# EAGLE design stepper-motor-driver (EAGLE 9.6.2)
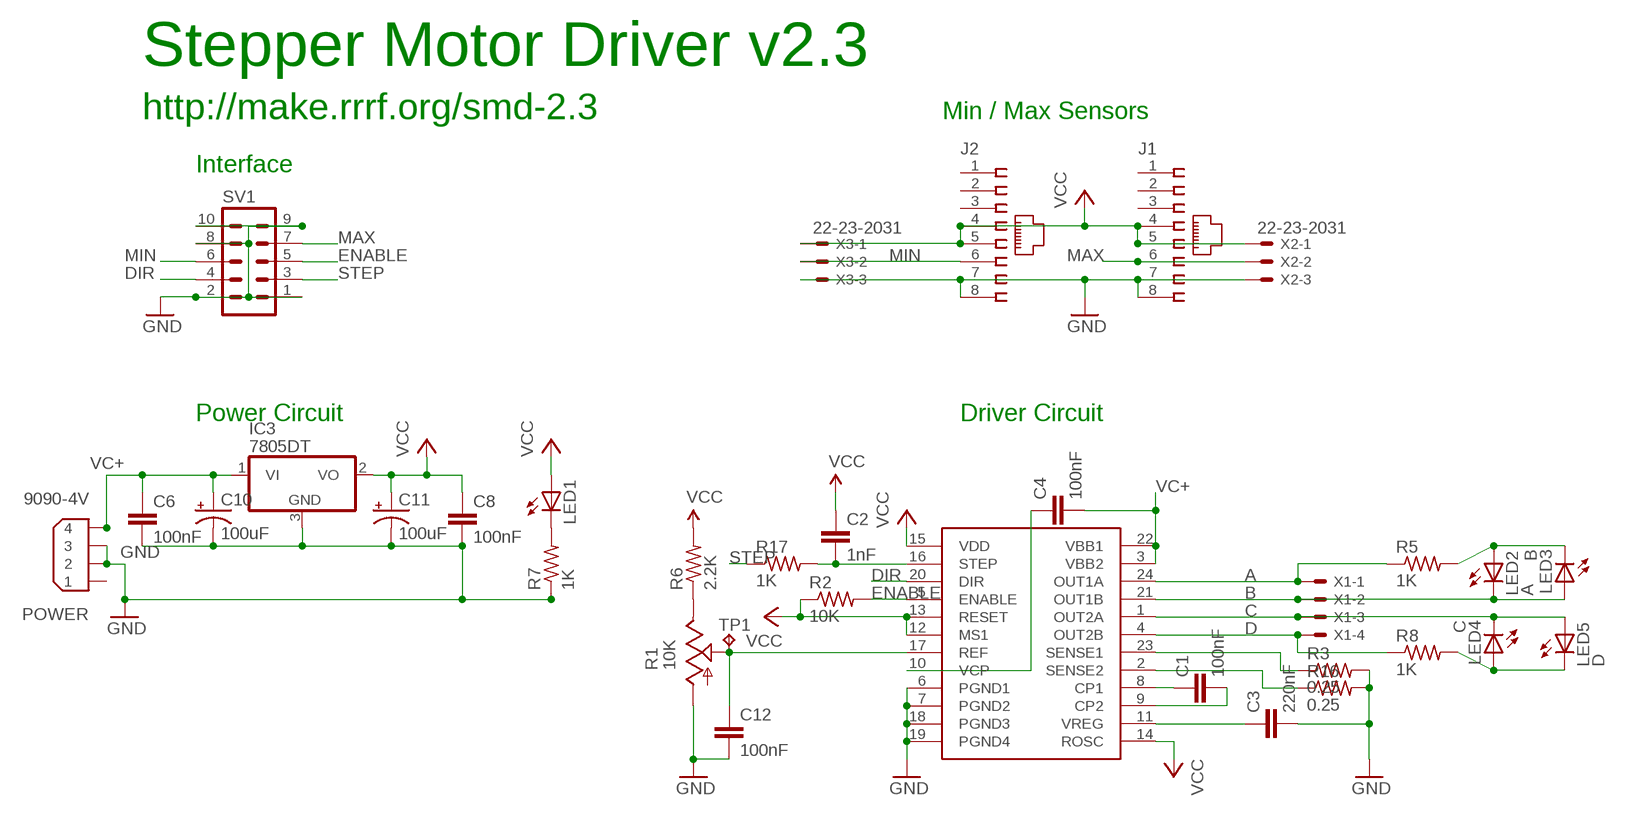
[diagram p0: schematic, sheet 1]

## Parts
C1  100nF  C-EUC1206  [C1206]
C2  1nF  C-EUC1206K  [C1206K]
C3  220nF  C-EUC1206  [C1206]
C4  100nF  C-EUC1206  [C1206]
C6  100nF  C-EUC1206K  [C1206K]
C8  100nF  C-EUC1206K  [C1206K]
C10  100uF  CPOL-USUD-10X10  [UD-10X10_NICHICON]
C11  100uF  CPOL-USUD-10X10  [UD-10X10_NICHICON]
C12  100nF  C-EUC1206  [C1206]
DRIVER  A3982  A3982SOIC24  [SO24W]
IC3  7805DT  [TO252]
J1  520426-4  [520426-4]
J2  520426-4  [520426-4]
LED1  LEDCHIPLED_1206  [CHIPLED_1206]
LED2  A  LEDCHIPLED_1206  [CHIPLED_1206]
LED3  B  LEDCHIPLED_1206  [CHIPLED_1206]
LED4  C  LEDCHIPLED_1206  [CHIPLED_1206]
LED5  D  LEDCHIPLED_1206  [CHIPLED_1206]
POWER  9090-4V  [9090-4V]
R1  10K  TRIM_US-B25P  [B25P]
R2  10K  R-US_R1206  [R1206]
R3  0.25  R-US_R2512  [R2512]
R5  1K  R-US_R1206  [R1206]
R6  2.2K  R-US_R1206  [R1206]
R7  1K  R-US_R1206  [R1206]
R8  1K  R-US_R1206  [R1206]
R16  0.25  R-US_R2512  [R2512]
R17  1K  R-US_R1206  [R1206]
SV1  ML10  [ML10]
TP1  TPPAD1-13  [P1-13]
X1  KK-156-4  [KK-156-4]
X2  22-23-2031  [22-23-2031]
X3  22-23-2031  [22-23-2031]

## Nets
A [Power]: DRIVER.24(OUT1A) R5.1 X1.1
B [Power]: DRIVER.21(OUT1B) LED2.C LED3.A X1.2
C [Power]: DRIVER.1(OUT2A) LED4.C LED5.A X1.3
D [Power]: DRIVER.4(OUT2B) R8.1 X1.4
DIR: DRIVER.20(DIR) SV1.4
ENABLE: DRIVER.5(ENABLE) R2.2 SV1.5
GND [Power]: C3.2 C6.2 C8.2 C10.- C11.- C12.2 DRIVER.6(PGND1) DRIVER.7(PGND2) DRIVER.18(PGND3) DRIVER.19(PGND4) IC3.3(GND) J1.7 J1.8 J2.7 J2.8 POWER.2 POWER.3 R1.A R3.2 R7.1 R16.2 SV1.1 SV1.2 SV1.8 SV1.9 SV1.10 X2.3 X3.3
MAX: J1.6 SV1.7 X2.2
MIN: J2.6 SV1.6 X3.2
N$1 [Power]: DRIVER.23(SENSE1) R3.1
N$2 [Power]: DRIVER.2(SENSE2) R16.1
N$3: C1.1 DRIVER.8(CP1)
N$4: C1.2 DRIVER.9(CP2)
N$5: C3.1 DRIVER.11(VREG)
N$6: R1.E R6.1
N$7: C4.1 DRIVER.10(VCP)
N$8: LED1.C R7.2
N$10 [Power]: LED2.A LED3.C R5.2
N$12 [Power]: LED4.A LED5.C R8.2
N$13: C12.1 DRIVER.17(REF) R1.S TP1.1(TP)
N$14: C2.2 DRIVER.16(STEP) R17.2
STEP: R17.1 SV1.3
VC+ [Power]: C4.2 C6.1 C10.+ DRIVER.3(VBB2) DRIVER.22(VBB1) IC3.1(VI) POWER.4
VCC: C2.1 C8.1 C11.+ DRIVER.12(MS1) DRIVER.13(RESET) DRIVER.14(ROSC) DRIVER.15(VDD) IC3.2(VO) J1.4 J1.5 J2.4 J2.5 LED1.A R2.1 R6.2 X2.1 X3.1
Unconnected: J1.1 J1.2 J1.3 J2.1 J2.2 J2.3 POWER.1

## Notes on the sheet
- Stepper Motor Driver v2.3
- http://make.rrrf.org/smd-2.3 | Min / Max Sensors
- Interface
- Power Circuit | Driver Circuit

## Library data of the parts
C1-C4 C6 C8 = rcl:C-EU: CAPACITOR, European symbol
C10 C11 = rcl:CPOL-US: POLARIZED CAPACITOR, American symbol
C12 = resistor:C-EU: CAPACITOR, European symbol
DRIVER = reprap:A3982
IC3 = linear:78*: Positive VOLTAGE REGULATOR Source: http://cache.national.com/ds/LM/LM78L05.pdf http://www.fairchildsemi.com/ds/LM/LM7805.pdf
J1 J2 = con-amp:520426-4: AMP connector
LED1-LED5 = led:LED: LED OSRAM: - CHIPLED LG R971, LG N971, LY N971, LG Q971, LY Q971, LO R971, LY R971 LH N974, LH R974 LS Q976, LO Q976, LY Q976 LO Q996 - Hyper CHIPLED LW Q18S LB Q993, LB Q99A, LB R99A - SideLED LS A670, LO A670, LY A670, LG A670, LP A670 LB A673, LV A673, LT A673, LW A673 LH A674 LY A675 LS A676, LA A676, LO A676, LY A676, LW A676 LS A679, LY A679, LG A679 - Hyper Micro SIDELED® LS Y876, LA Y876, LO Y876, LY Y876 LT Y87S - SmartLED LW L88C, LW L88S LB L89C, LB L89S, LG L890 LS L89K, LO L89K, LY L89K LS L896, LA L896, LO L896, LY L896 - TOPLED LS T670, LO T670, LY T670, LG T670, LP T670 LSG T670, LSP T670, LSY T670, LOP T670, LYG T670 LG T671, LOG T671, LSG T671 LB T673, LV T673, LT T673, LW T673 LH T674 LS T676, LA T676, LO T676, LY T676, LB T676, LH T676, LSB T676, LW T676 LB T67C, LV T67C, LT T67C, LS T67K, LO T67K, LY T67K, LW E67C LS E67B, LA E67B, LO E67B, LY E67B, LB E67C, LV E67C, LT E67C LW T67C LS T679, LY T679, LG T679 LS T770, LO T770, LY T770, LG T770, LP T770 LB T773, LV T773, LT T773, LW T773 LH T774 LS E675, LA E675, LY E675, LS T675 LS T776, LA T776, LO T776, LY T776, LB T776 LHGB T686 LT T68C, LB T68C - Hyper Mini TOPLED® LB M676 - Mini TOPLED Santana® LG M470 LS M47K, LO M47K, LY M47K Source: http://www.osram.convergy.de - LUMILED® LXK2-PW12-R00, LXK2-PW12-S00, LXK2-PW14-U00, LXK2-PW14-V00 LXK2-PM12-R00, LXK2-PM12-S00, LXK2-PM14-U00 LXK2-PE12-Q00, LXK2-PE12-R00, LXK2-PE12-S00, LXK2-PE14-T00, LXK2-PE14-U00 LXK2-PB12-K00, LXK2-PB12-L00, LXK2-PB12-M00, LXK2-PB14-N00, LXK2-PB14-P00, LXK2-PB14-Q00 LXK2-PR12-L00, LXK2-PR12-M00, LXK2-PR14-Q00, LXK2-PR14-R00 LXK2-PD12-Q00, LXK2-PD12-R00, LXK2-PD12-S00 LXK2-PH12-R00, LXK2-PH12-S00 LXK2-PL12-P00, LXK2-PL12-Q00, LXK2-PL12-R00 Source: www.luxeon.com
POWER = con-thomas-betts:9090-4: Disk Drive Power four position Source: Thomas & Betts Electronic Interconnects Eiropean Edition 1998
R1 = reprap:TRIM_US-: POTENTIOMETER
R2 R5 = resistor:R-US_: RESISTOR, American symbol
R3 R6-R8 R16 R17 = rcl:R-US_: RESISTOR, American symbol
SV1 = con-harting-ml:ML10: HARTING
TP1 = testpad:TP: Test pad
X1 = con-molex:KK-156-4: KK 156 HEADER Source: http://www.molex.com/pdm_docs/sd/026604100_sd.pdf
X2 X3 = con-molex:22-23-2031: .100" (2.54mm) Center Header - 3 Pin

## Net classes
0 default: width 0.381 mm
1 Power: width 0.635 mm, drill 0.381 mm, clearance 0.508 mm
2 Trunk: width 1.676 mm, clearance 0.508 mm

## Board
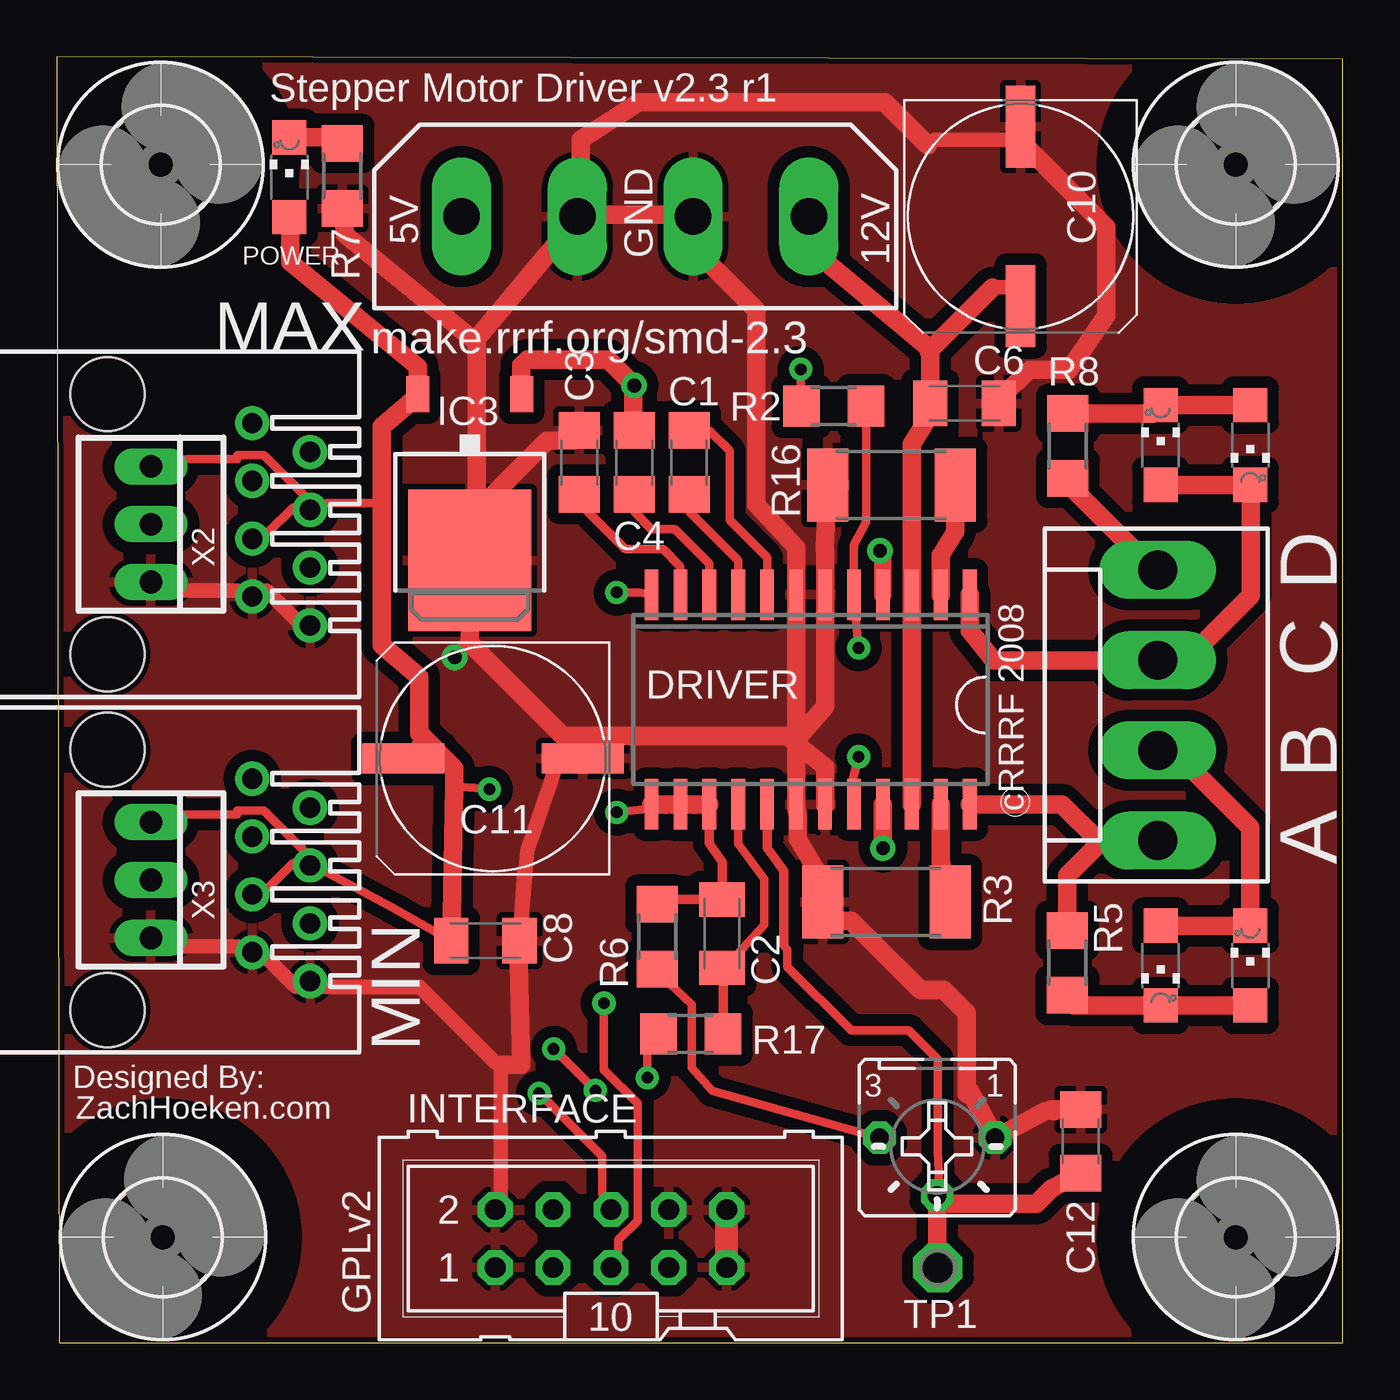
[diagram p1: board, top side]
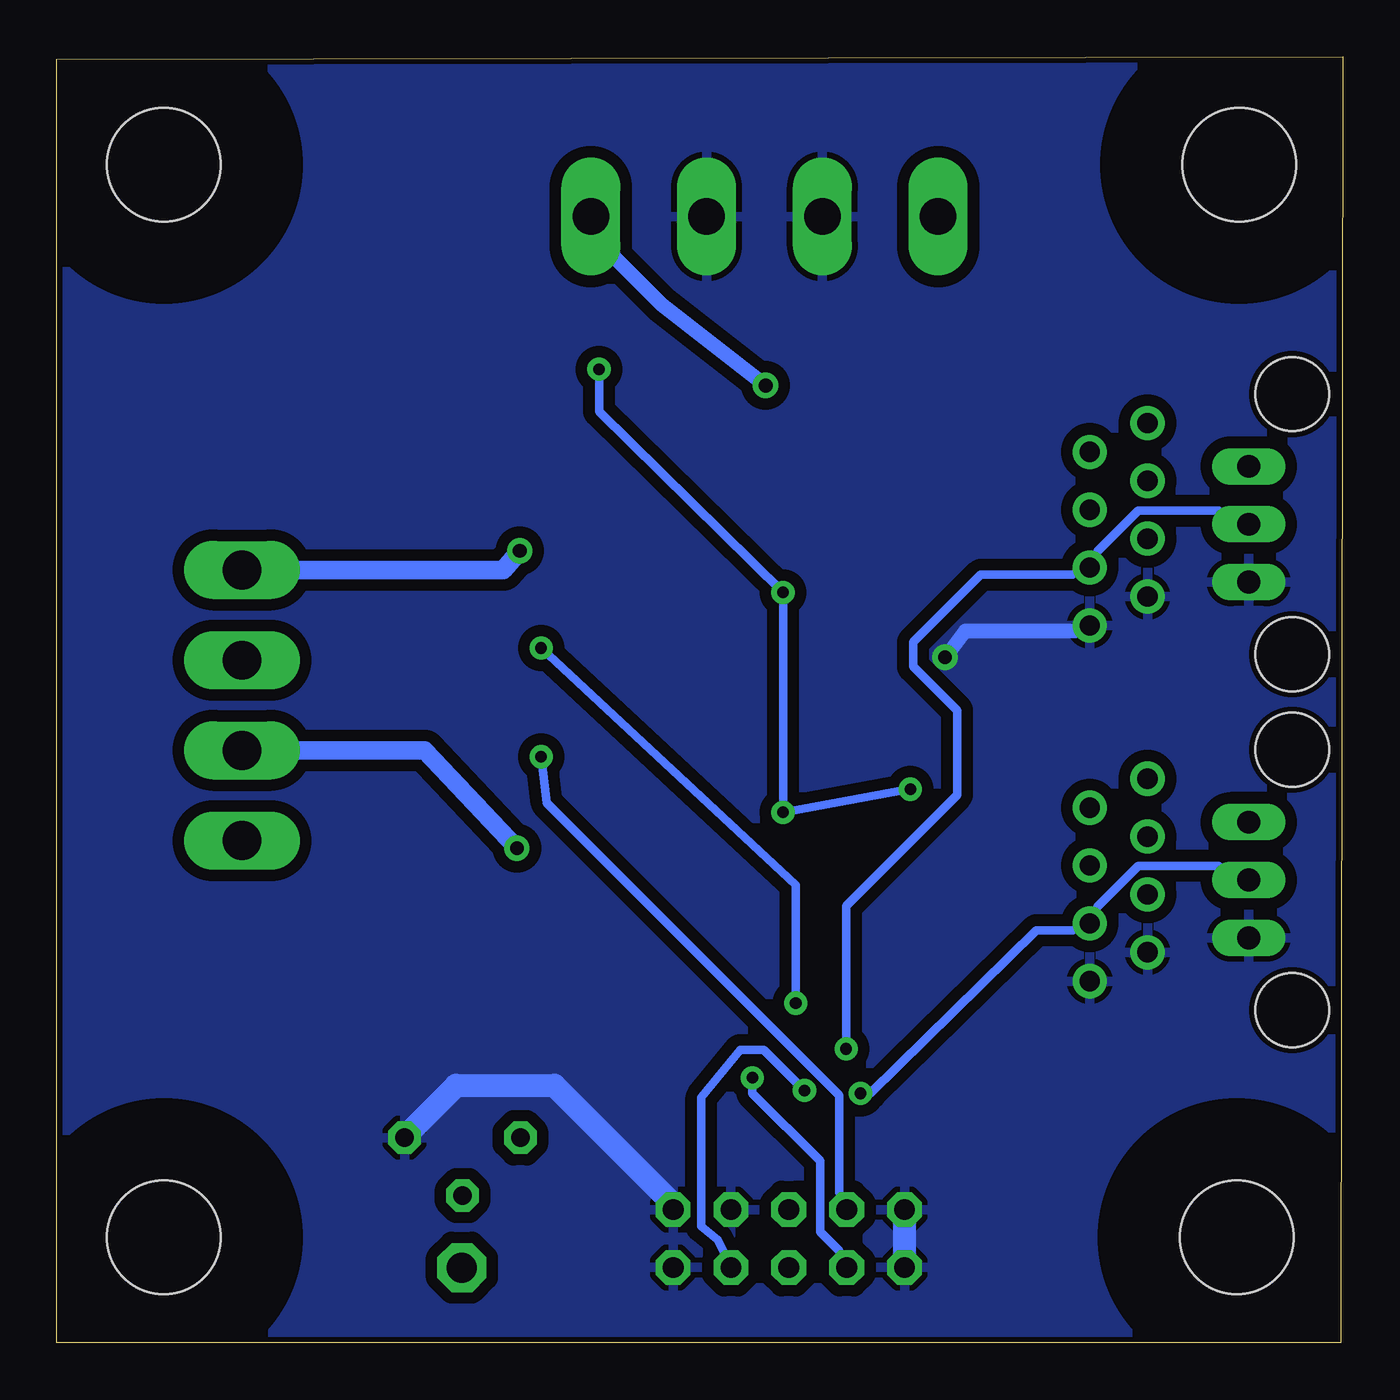
[diagram p2: board, bottom side, seen from below]

Size 56.45 x 56.46 mm. Coordinates in mm from the lower left corner, seen from the top.
Outline: 0.1,0 56.45,0 56.45,56.36 0,56.46 0.1,0
Copper layers (1*16): Top 0.035mm / dielectric 1.5mm / Bottom 0.035mm
Design rules "SparkFun": minimum track width 8mil, minimum drill 20mil, track to track 8mil, track to pad 8mil, pad to pad 8mil, via to via 8mil, smd to smd 8mil, copper to edge 10mil, drill to drill 8mil, minimum pad ring 12mil, minimum via ring 10mil, stop-mask expansion 4mil, vias tented up to drill 25mil, thermal gap 10mil

### Footprints (pad centres in the part's own frame; a part is rotated, then mirrored left to right if it is on the bottom)
C1206 = smd 1.6 x 1.8: 1 -1.4,0; 2 1.4,0
C1206K = smd 1.5 x 2: 1 -1.5,0; 2 1.5,0
UD-10X10_NICHICON = smd 3.6 x 1.3: + 3.925,0; - -3.95,0
SO24W = smd 0.6 x 2.2: 1 -6.985,-4.6; 2 -5.715,-4.6; 3 -4.445,-4.6; 4 -3.175,-4.6; 5 -1.905,-4.6; 6 -0.635,-4.6; 7 0.635,-4.6; 8 1.905,-4.6; 9 3.175,-4.6; 10 4.445,-4.6; 11 5.715,-4.6; 12 6.985,-4.6; 13 6.985,4.6; 14 5.715,4.6; 15 4.445,4.6; 16 3.175,4.6; 17 1.905,4.6; 18 0.635,4.6; 19 -0.635,4.6; 20 -1.905,4.6; 21 -3.175,4.6; 22 -4.445,4.6; 23 -5.715,4.6; 24 -6.985,4.6
TO252 = smd 1 x 1.6: 1 -2.28,-4.8; 2 2.28,-4.8 | smd 5.4 x 6.2: 3 0,2.5
520426-4 = drill 0.889: 1 -4.445,6.35; 2 -3.175,8.89; 3 -1.905,6.35; 4 -0.635,8.89; 5 0.635,6.35; 6 1.905,8.89; 7 3.175,6.35; 8 4.445,8.89 | hole 3.251: -5.715,0; 5.715,0
CHIPLED_1206 = smd 1.5 x 1.5: A 0,-1.75; C 0,1.75
9090-4V = drill 1.6 pad 2.6 long: 1 -7.62,0; 2 -2.54,0; 3 2.54,0; 4 7.62,0
B25P = drill 0.813 octagon: A -2.54,0; E 2.54,0; S 0,2.54
R1206 = smd 1.6 x 1.803: 1 -1.422,0; 2 1.422,0
R2512 = smd 1.8 x 3.2: 1 -2.8,0; 2 2.8,0
ML10 = drill 0.914 octagon: 1 -5.08,-1.27; 2 -5.08,1.27; 3 -2.54,-1.27; 4 -2.54,1.27; 5 0,-1.27; 6 0,1.27; 7 2.54,-1.27; 8 2.54,1.27; 9 5.08,-1.27; 10 5.08,1.27
P1-13 = drill 1.321 pad 2.159 octagon: 1 0,0
5,0 = hole 5: 0,0
KK-156-4 = drill 1.7 pad 2.184 long: 1 -5.94,0; 2 -1.98,0; 3 1.98,0; 4 5.94,0
22-23-2031 = drill 1 long: 1 -2.54,0; 2 0,0; 3 2.54,0

### Placement (x,y rotation side)
C1  27.75,38.65 270 top
C2  29.2,17.95 270 top
C3  22.92,38.65 90 top
C4  25.34,38.65 90 top
C6  39.84,41.24 0 top
C8  18.81,17.65 0 top
C10  42.3,49.45 270 top
C11  19.14,25.65 180 top
C12  44.94,8.84 90 top
DRIVER  33.08,28.24 180 top
IC3  18.12,36.85 180 top
J1  2.22,35.94 270 top
J2  2.22,20.31 270 top
LED1  10.2,51.17 0 top
LED2  52.39,16.56 0 top
LED3  48.45,16.56 180 top
LED4  52.39,39.42 180 top
LED5  48.45,39.42 0 top
POWER  25.39,49.45 0 top
R1  38.64,9 180 top
R2  34.1,41.12 0 top
R3  36.41,19.35 180 top
R5  44.36,16.67 270 top
R6  26.35,17.83 90 top
R7  12.53,51.23 90 top
R8  44.38,39.38 90 top
R16  36.64,37.66 180 top
R17  27.82,13.56 0 top
SV1  24.32,4.57 0 top
TP1  38.67,3.29 0 top
U$1  [5,0]  4.55,51.73 0 top
U$2  [5,0]  51.75,51.73 0 top
U$3  [5,0]  4.65,4.63 0 top
U$4  [5,0]  51.75,4.63 0 top
X1  48.32,27.99 90 top
X2  4.13,35.94 270 top
X3  4.13,20.31 270 top

### Tracks (layer width: path | path; a pad name or v marks a point on that pad's centre or on a via)
A
  Top 0.813: DRIVER.24 44.11,23.64 45.71,22.04 45.93,22.04 | X1.1 48.28,22.05 48.27,22.04 45.93,22.04 | 45.93,22.04 45.93,22.09 44.36,20.51 R5.1
B  (via drill 0.6)
  Top 0.813: v36.26,21.71 DRIVER.21 | 52.39,18.33 LED2.C 52.36,18.31 | 52.36,18.31 LED3.A | X1.2 49.01,26.01 52.39,22.63 52.39,18.33 | 52.36,18.31 52.28,18.23 | 52.39,18.33 52.36,18.31
  Bottom 0.813: X1.2 40.3,26.01 v36.26,21.71
C
  Top 0.813: DRIVER.1 40.07,31.26 41.13,29.94 48.25,29.94 48.27,29.97 X1.3 49.56,29.97 52.41,32.81 52.41,37.54 52.28,37.67 | 48.43,37.67 LED5.A | 48.43,37.67 LED4.C 52.28,37.67 | 48.43,37.67 48.32,37.56 | 52.28,37.67 52.16,37.79
D  (via drill 0.6)
  Top 0.762: DRIVER.4 36.26,34.67 36.13,34.79 v36.13,34.77
  Top 0.813: R8.1 44.27,37.95 44.21,37.89 48.17,33.93 X1.4
  Bottom 0.813: X1.4 36.84,33.93 v36.13,34.77
DIR  (via drill 0.51)
  Top 0.381: v35.19,25.73 34.94,24.73 DRIVER.20
  Bottom 0.381: v35.19,25.73 34.94,23.69 22.11,10.87 22.11,6.57 SV1.4
ENABLE  (via drill 0.51)
  Top 0.381: R2.2 35.52,36.06 34.99,35.02 DRIVER.5 | DRIVER.5 34.99,32.81 | v24.01,14.9 24.01,11.98 25.49,10.51 25.49,5.35 24.65,4.52 24.65,4.03 SV1.5 | v35.19,30.5 35.06,31.74 DRIVER.5
  Bottom 0.381: v24.01,14.9 24.01,20.09 v35.19,30.5
GND  (via drill 0.61)
  Top 0.406: 18.43,36.01 18.3,36.01 | C3.2 22.34,40.05
  Top 0.635: J1.8 10.48,31.74 9.21,33.02 J1.7 7.94,33.02 5.52,33.02 X2.3 | X3.3 5.52,17.39 7.94,17.39 J2.7 9.21,16.89 10.48,15.62 J2.8 11.75,15.62 15.94,15.62 19.24,12.31 19.49,12.19 19.49,6.47 SV1.2 | v17.46,30.09 17.84,30.48 18.12,30.73 | C8.2 20.51,20.7 | 20.26,17.52 C8.2 | C8.2 20.64,21.59 22.03,25.65 C11.- 22.29,26.66 22.21,26.64 | 38.24,52.57 38.54,52.83 42.1,52.83 C10.- | IC3.3 18.1,34.41 IC3.3
  Top 0.813: R16.2 33.71,34.91 33.72,34.67 33.72,32.89 | 28.05,49.85 28.03,49.6 POWER.3 | 28.05,49.85 27.93,48.1 30.69,45.33 30.69,36.8 32.45,34.92 DRIVER.7 32.45,26.56 | 28.05,49.85 27.9,49.52 23.02,49.52 23.02,49.45 | POWER.2 22.92,49.47 18.43,44.09 18.43,43.91 | 18.43,43.91 18.43,36.01 18.43,34.54 18.17,34.28 IC3.3 18.12,30.73 22.21,26.64 | POWER.2 23.02,49.42 23.02,49.45 | 32.45,26.56 32.19,26.54 33.72,25.27 DRIVER.19 33.72,23.59 | 32.45,26.49 DRIVER.18 32.45,23.49 32.52,23.16 32.52,22.12 33.41,20.65 R3.2 33.61,18.52 34.88,18.52 37.91,15.49 38.92,15.49 39.94,14.47 39.94,11.17 | 32.45,26.49 33.72,27.93 33.72,32.89 | 33.72,32.89 DRIVER.6 | 38.24,52.57 36.33,54.48 25.54,54.48 23,52.83 23,49.47 23.02,49.45 | POWER.2 23.02,49.45 | 22.21,26.64 22.24,26.66 | 32.45,26.56 32.45,26.49 | 22.21,26.64 32.37,26.64 32.45,26.56 | R7.1 12.66,48.66 18.43,43.91 | 19.49,12.19 20.38,12.19 20.26,17.52 20.26,17.65 | C6.2 41.34,41.45 42.73,42.72 44.44,42.72 46.06,45.1 46.06,48.99 42.48,52.57 | 42.48,52.57 42.45,52.6 | C10.- 42.48,52.57 | R1.A 40.07,11.05 39.94,10.92 39.94,11.17 | 39.94,11.17 39.94,12.19 | 43.67,10.24 43.75,10.15 | 43.67,10.24 C12.2 | R1.A 43.37,10.16 43.67,10.24 | 39.94,11.17 40.06,11.05 R1.A | 18.3,36.01 18.3,36.39 21.52,39.62 22.67,39.62 23.05,40 23,40.05 C3.2
  Top 1.016: SV1.9 SV1.10
  Bottom 0.635: v17.46,30.09 16.57,31.24 11.75,31.24 J1.8
  Bottom 1.016: 29.14,5.84 34.61,11.3 38.92,11.3 41.21,9.01 41.2,9 R1.A | SV1.2 19.37,5.84 19.24,5.71 SV1.1
  pour Bottom: -1.21,57.91 57.21,57.91 57.21,-0.51 -1.21,-0.51
  pour Top: -1.21,57.91 57.21,57.91 57.21,-0.51 -1.21,-0.51
MAX  (via drill 0.51)
  Top 0.381: v23.63,11.07 v21.8,12.9
  Bottom 0.381: X2.2 5.45,36.55 8.98,36.55 10.78,34.74 J1.6 11.85,33.73 15.89,33.73 18.86,30.75 18.86,29.69 16.93,27.76 16.93,24.05 21.8,19.17 v21.8,12.9 | v23.63,11.07 25.41,12.85 26.45,12.85 28.15,10.76 28.15,5.1 27.44,4.52 27.19,4.03 SV1.7
MIN  (via drill 0.51)
  Top 0.381: v21.17,10.94 23.94,8.17 23.94,6.52 SV1.6
  Bottom 0.381: X3.2 5.45,20.92 8.98,20.92 10.78,19.12 J2.6 11.85,18.1 13.45,18.1 20.74,10.94 v21.17,10.94
N$1
  Top 0.813: 39.21,19.73 39.18,19.83 | R3.1 39.21,19.73 | DRIVER.23 38.8,21.13 39.21,19.73
N$2
  Top 0.813: R16.1 39.44,35.61 38.8,34.59 DRIVER.2
N$3
  Top 0.381: C1.1 28.63,40.05 29.53,39.16 29.53,36.11 31.18,34.46 DRIVER.8 31.18,32.81
N$4
  Top 0.381: C1.2 27.75,36.49 29.91,34.34 DRIVER.9 29.91,32.81
N$5
  Top 0.381: C3.1 22.92,36.88 24.95,34.84 26.61,34.84 27.37,34.08 DRIVER.11 27.37,32.81
N$6
  Top 0.381: R1.E 28.76,11.05 27.88,12.06 27.88,14.85 26.22,16.38 26.25,16.4 R6.1
N$7
  Top 0.381: C4.1 25.34,36.49 26.1,35.73 27.11,35.73 28.64,34.21 DRIVER.10
N$8
  Top 0.813: R7.2 12.66,52.55 12.63,52.52 12.23,52.92 LED1.C
N$10
  Top 0.813: LED2.A 48.73,14.81 48.6,14.68 48.47,14.81 LED3.C 44.64,14.81 44.21,15.24 44.22,15.25 R5.2
N$12
  Top 0.813: 48.5,41.17 48.53,41.19 | 48.5,41.17 LED5.C LED4.A | R8.2 48.13,40.8 48.5,41.17 | LED4.A | LED4.A 52.44,41.12
N$13
  Top 0.381: 38.7,6.44 38.7,7.52 38.67,8.38 38.67,12.44 37.4,13.71 34.86,13.71 32.07,16.51 32.07,17.27 31.81,17.52 31.91,17.52
  Top 0.406: 31.91,17.52 31.91,20.72 31.18,21.71 31.18,23.54 31.15,23.57 31.18,23.59 DRIVER.17
  Top 0.813: C12.1 43.67,6.77 42.99,6.09 39.18,6.09 38.64,6.63 R1.S | TP1.1 38.64,3.32 R1.S | R1.S 38.7,6.44
N$14
  Top 0.381: C2.2 29.58,16.73 31.05,18.33 31.05,20.37 29.91,21.89 DRIVER.16
  Top 0.406: C2.2 29.22,16.45 29.25,16.43 R17.2
STEP  (via drill 0.51)
  Top 0.381: v25.92,11.63 25.92,12.67 R17.1
  Bottom 0.381: v25.92,11.63 25.92,10.94 22.95,7.97 22.95,4.87 22.11,4.03 SV1.3
VC+  (via drill 0.61)
  Top 0.406: C4.2 25.34,40.02 25.31,40.05
  Top 0.635: C10.+ 42.1,46.35 41.34,46.35 41.06,46.32
  Top 0.813: DRIVER.22 DRIVER.3 37.53,39.47 38.26,40.63 C6.1 38.34,43.53 | 38.34,43.53 38.34,43.63 33.01,48.08 33.13,48.97 33.18,49.12 POWER.4 | 38.34,43.53 38.26,43.53 41.06,46.32 | 25.31,40.05 25.31,42.01 v25.34,42.03 24.19,43.17 20.64,43.17 20.38,42.92 20.38,41.65 IC3.1
  Bottom 0.635: v25.34,42.03 29.91,45.59 31.94,47.62 POWER.4
VCC  (via drill 0.51)
  Top 0.381: C11.+ 16.06,26.66 16.03,26.63 | v32.65,42.74 32.65,42.01 R2.1 | v24.57,32.94 25.56,32.94 DRIVER.12 | v24.57,23.29 25.69,23.41 DRIVER.13 | J1.5 9.31,35.61 10.37,36.67 J1.4 | X2.1 5.73,38.81 7.91,38.81 7.91,38.98 9.08,38.98 10.78,37.28 J1.4 | J2.5 9.31,19.98 10.37,21.05 J2.4 | X3.1 5.73,23.18 7.91,23.18 7.91,23.36 9.08,23.36 10.78,21.66 J2.4 | J2.4 11.85,20.65 14.67,19.12 C8.1 | J1.4 11.85,36.88 14.26,36.88 | 17.43,24.43 v18.98,24.3
  Top 0.406: DRIVER.15 28.36,23.64 28.33,23.62 28.64,23.57 28.64,21.91 29.2,21.1 C2.1 26.58,19.45 26.38,19.25 R6.2
  Top 0.813: C8.1 17.43,24.43 17.43,25.22 16.03,26.63 15.91,26.74 15.91,29.23 14.26,30.63 14.26,36.88 14.26,40.23 15.91,41.63 15.89,41.65 IC3.2 15.84,42.86 10.25,47.44 10.25,49.47 10.22,49.5 10.2,49.48 LED1.A | 26.73,23.64 DRIVER.14 28,23.64 | DRIVER.13 26.73,23.64 | 26.73,23.64 26.73,23.62 | 28,23.64 DRIVER.15 | 28,23.64 28,23.62
  Bottom 0.381: v32.65,42.74 32.65,40.89 v24.57,32.94 v24.57,23.29 v18.98,24.3

### Text on the board
tPlace: Stepper Motor Driver v2.3 r1 | 5V | POWER | GND | 12V | MAX | make.rrrf.org/smd-2.3 | D | C | B | cRRRF 2008 | A | MIN | Designed By: | INTERFACE | ZachHoeken.com | GPLv2